# EAGLE design xambi_mini_pro (EAGLE 6.5.4)
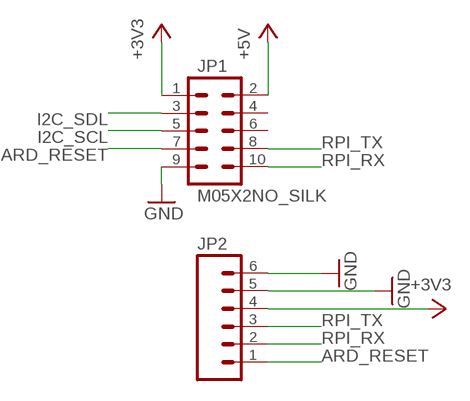
[diagram p0: schematic, sheet 1]

## Parts
JP1  M05X2NO_SILK  [2X5_NOSILK]
JP2  M06POLAR  [MOLEX-1X6]

## Nets
+3V3: JP1.1 JP2.4
+5V: JP1.2
ARD_RESET: JP1.7 JP2.1
GND: JP1.9 JP2.5 JP2.6
I2C_SCL: JP1.5
I2C_SDL: JP1.3
RPI_RX: JP1.10 JP2.2
RPI_TX: JP1.8 JP2.3
Unconnected: JP1.4 JP1.6

## Library data of the parts
JP1 = SparkFun-Connectors:M05X2: Header 5x2 Standard 10-pin dual row 0.1" header. Commonly used with AVR-ISP. Use with Spark Fun Electronics SKU: PRT-00778
JP2 = SparkFun-Connectors:M06: Header 6 Standard 6-pin 0.1" header. Use with straight break away headers (SKU : PRT-00116), right angle break away headers (PRT-00553), swiss pins (PRT-00743), machine pins (PRT-00117), and female headers (PRT-00115). Molex polarized connector foot print use with SKU : PRT-08094 with associated crimp pins and housings. NOTES ON THE VARIANTS LOCK and LOCK_LONGPADS... This footprint was designed to help hold the alignment of a through-hole component (i.e. 6-pin header) while soldering it into place. You may notice that each hole has been shifted either up or down by 0.005 of an inch from it's more standard position (which is a perfectly straight line). This slight alteration caused the pins (the squares in the middle) to touch the edges of the holes. Because they are alternating, it causes a "brace" to hold the component in place. 0.005 has proven to be the perfect amount of "off-center" position when using our standard breakaway headers. Although looks a little odd when you look at the bare footprint, once you have a header in there, the alteration is very hard to notice. Also,if you push a header all the way into place, it is covered up entirely on the bottom side. This idea of altering the position of holes to aid alignment will be further integrated into the Sparkfun Library for other footprints. It can help hold any component with 3 or more connection pins.

## Board
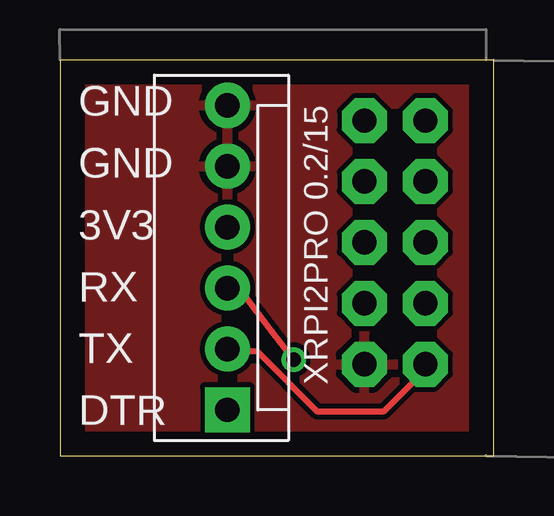
[diagram p1: board, top side]
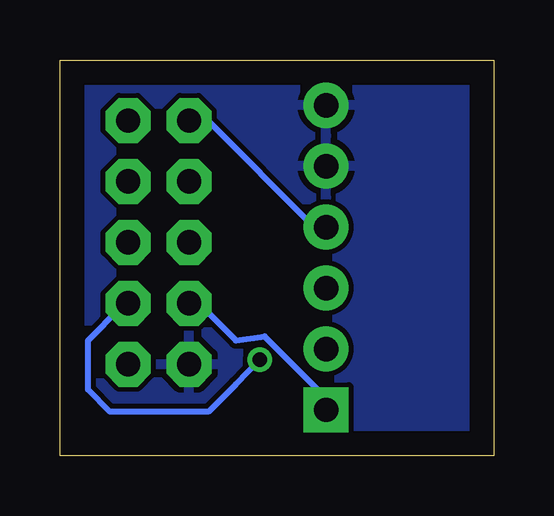
[diagram p2: board, bottom side, seen from below]

Size 18.09 x 16.5 mm. Coordinates in mm from the lower left corner, seen from the top.
Outline: 0,0 18.09,0 18.09,16.5 0,16.5 0,0
Copper layers (1*16): Top 0.035mm / dielectric 1.5mm / Bottom 0.035mm
Design rules "default": minimum track width 10mil, minimum drill 24mil, track to track 8mil, track to pad 8mil, pad to pad 8mil, via to via 8mil, smd to smd 8mil, copper to edge 40mil, drill to drill 8mil, minimum pad ring 10mil, minimum via ring 8mil, stop-mask expansion 4mil, vias tented up to drill 0mil, thermal gap 10mil

### Footprints (pad centres in the part's own frame; a part is rotated, then mirrored left to right if it is on the bottom)
2X5_NOSILK = drill 1.016 pad 1.88 octagon: 1 -1.27,5.08; 2 1.27,5.08; 3 -1.27,2.54; 4 1.27,2.54; 5 -1.27,0; 6 1.27,0; 7 -1.27,-2.54; 8 1.27,-2.54; 9 -1.27,-5.08; 10 1.27,-5.08
MOLEX-1X6 = drill 1.016 pad 1.88 square: 1 0,0 | drill 1.016 pad 1.88: 2 2.54,0; 3 5.08,0; 4 7.62,0; 5 10.16,0; 6 12.7,0

### Placement (x,y rotation side)
JP1  13.97,8.89 0 top
JP2  6.99,1.91 90 top

### Tracks (layer width: path | path; a pad name or v marks a point on that pad's centre or on a via)
+3V3
  Bottom 0.254: JP2.4 7.09,9.6 7.54,9.6 11.89,13.95 12.57,13.95 JP1.1
ARD_RESET
  Bottom 0.254: JP2.1 7.09,2.06 7.03,2.46 9.54,4.97 10.74,4.8 12.12,6.17 12.57,6.17 JP1.7
GND
  pour Bottom: 0,0 19.05,0 19.05,17.78 0,17.78
  pour Top: 0,0 19.05,0 19.05,17.78 0,17.78
RPI_RX
  Top 0.254: JP2.2 7.09,4.34 8.23,4.34 10.74,1.83 13.49,1.83 15.32,3.66 JP1.10
RPI_TX  (via drill 0.61)
  Top 0.254: v9.74,4 8.84,5.16 7.54,6.86 7.09,6.86 JP2.3
  Bottom 0.254: v9.74,4 10.74,2.97 11.89,1.83 16,1.83 16.92,2.74 16.92,4.8 15.54,6.17 15.32,6.17 JP1.8

### Text on the board
tNames: XRPI2PRO 0.2/15 | GND / GND / 3V3 / RX / TX / DTR